# EAGLE board mosfet_ctl (EAGLE 9.6.0), part 1 of 2
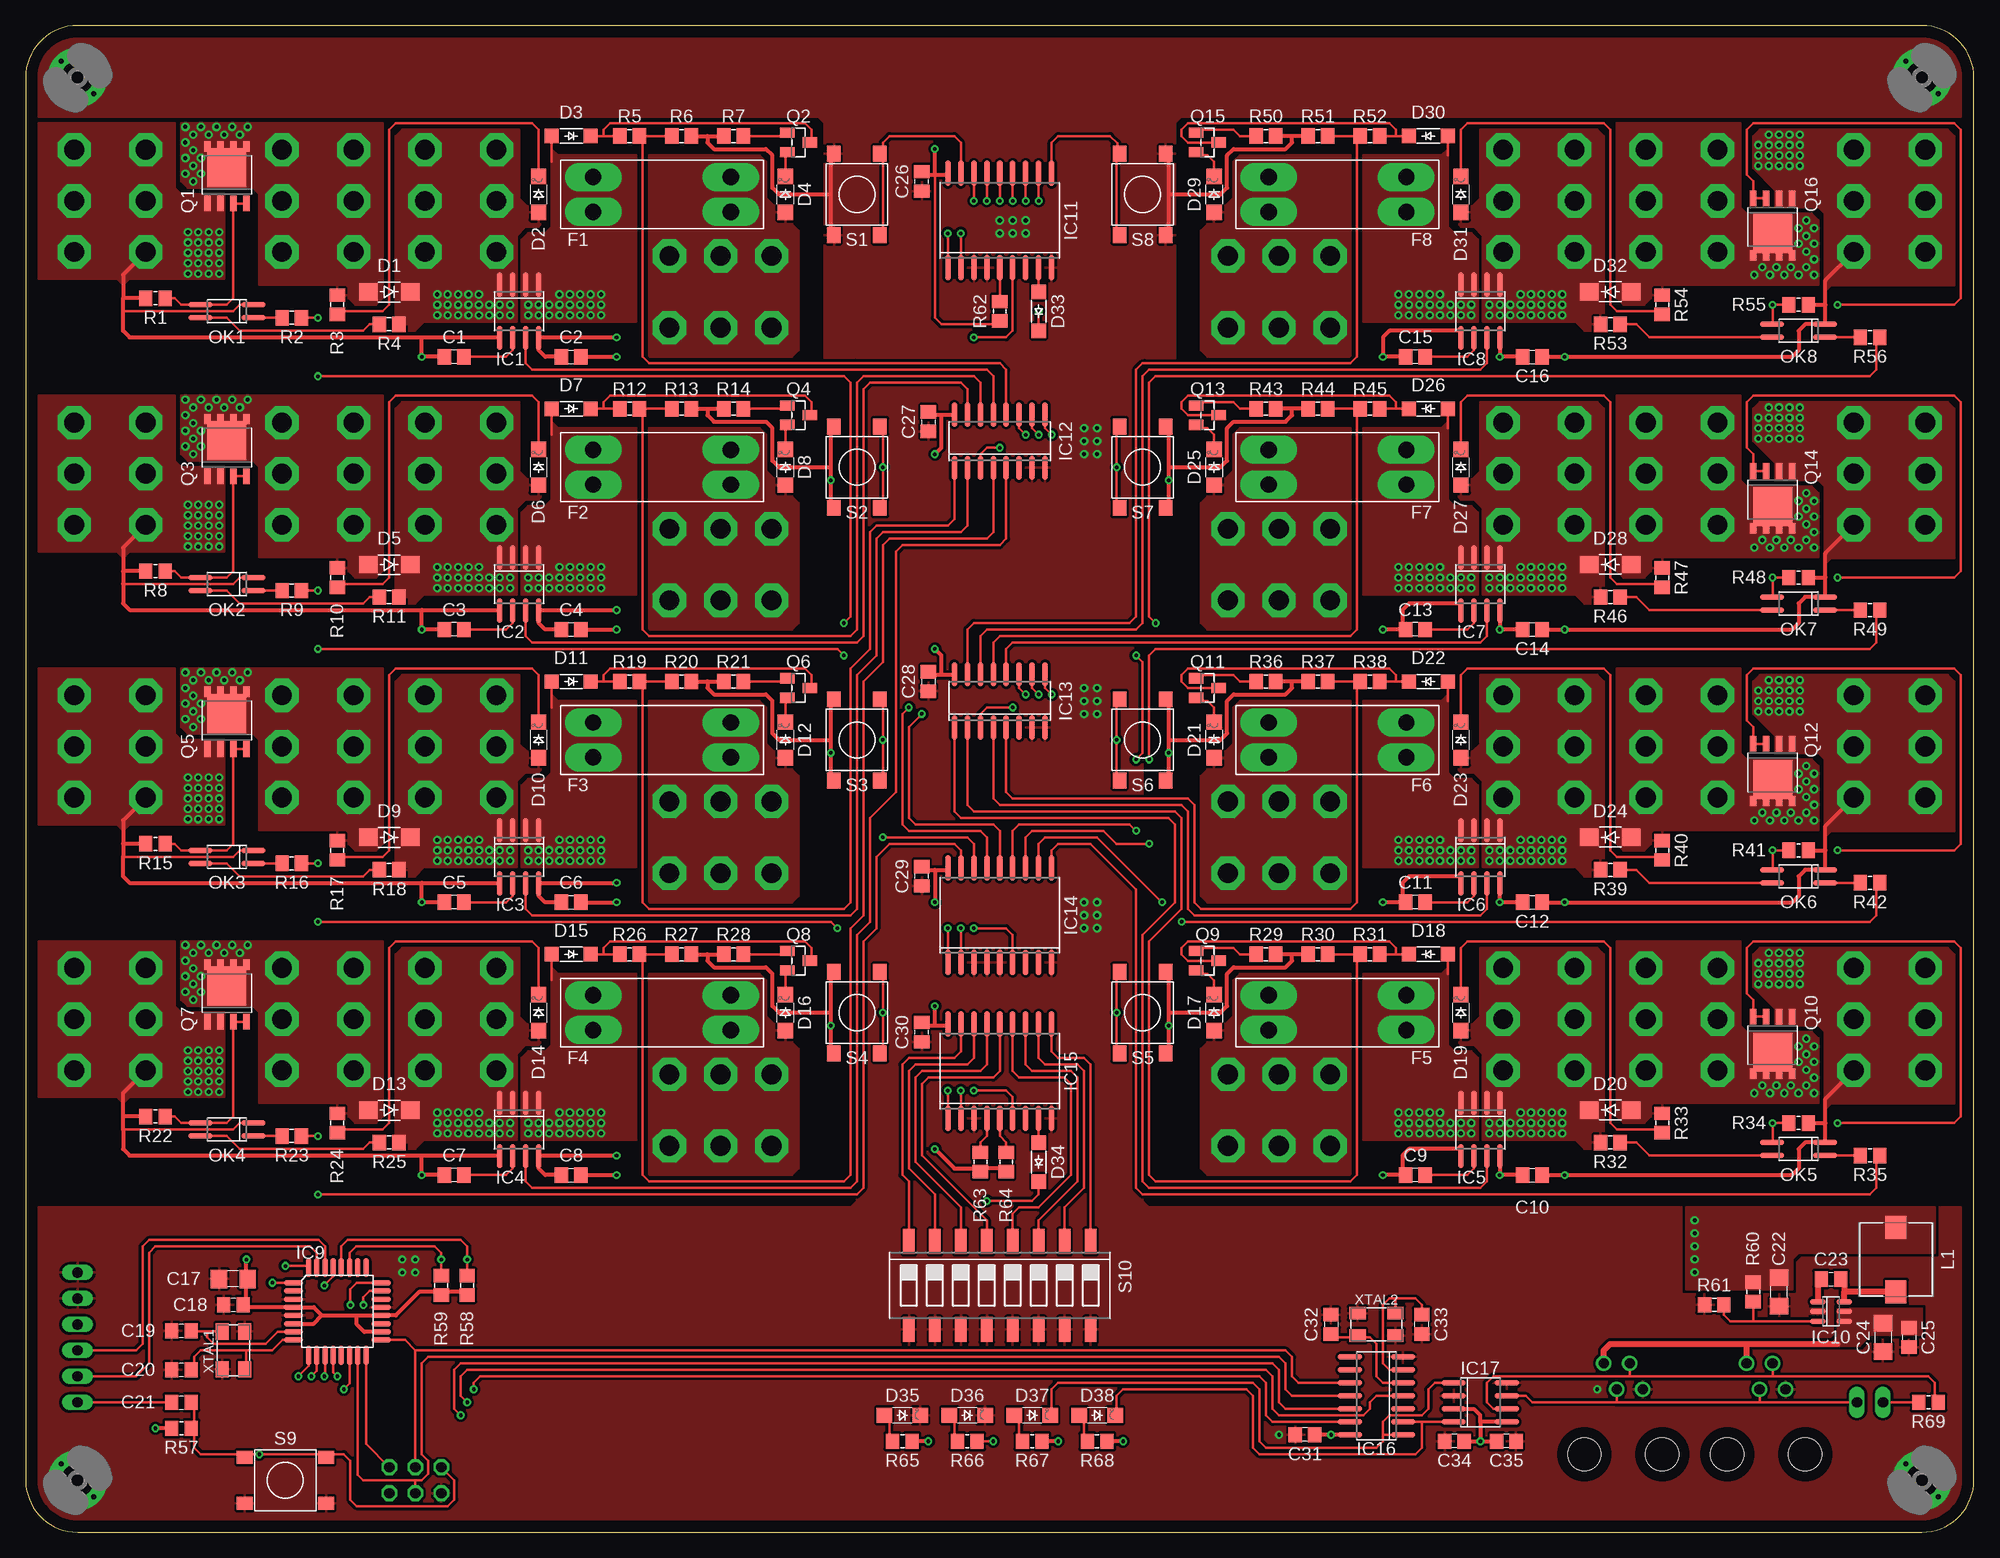
[diagram p3: board, top side]
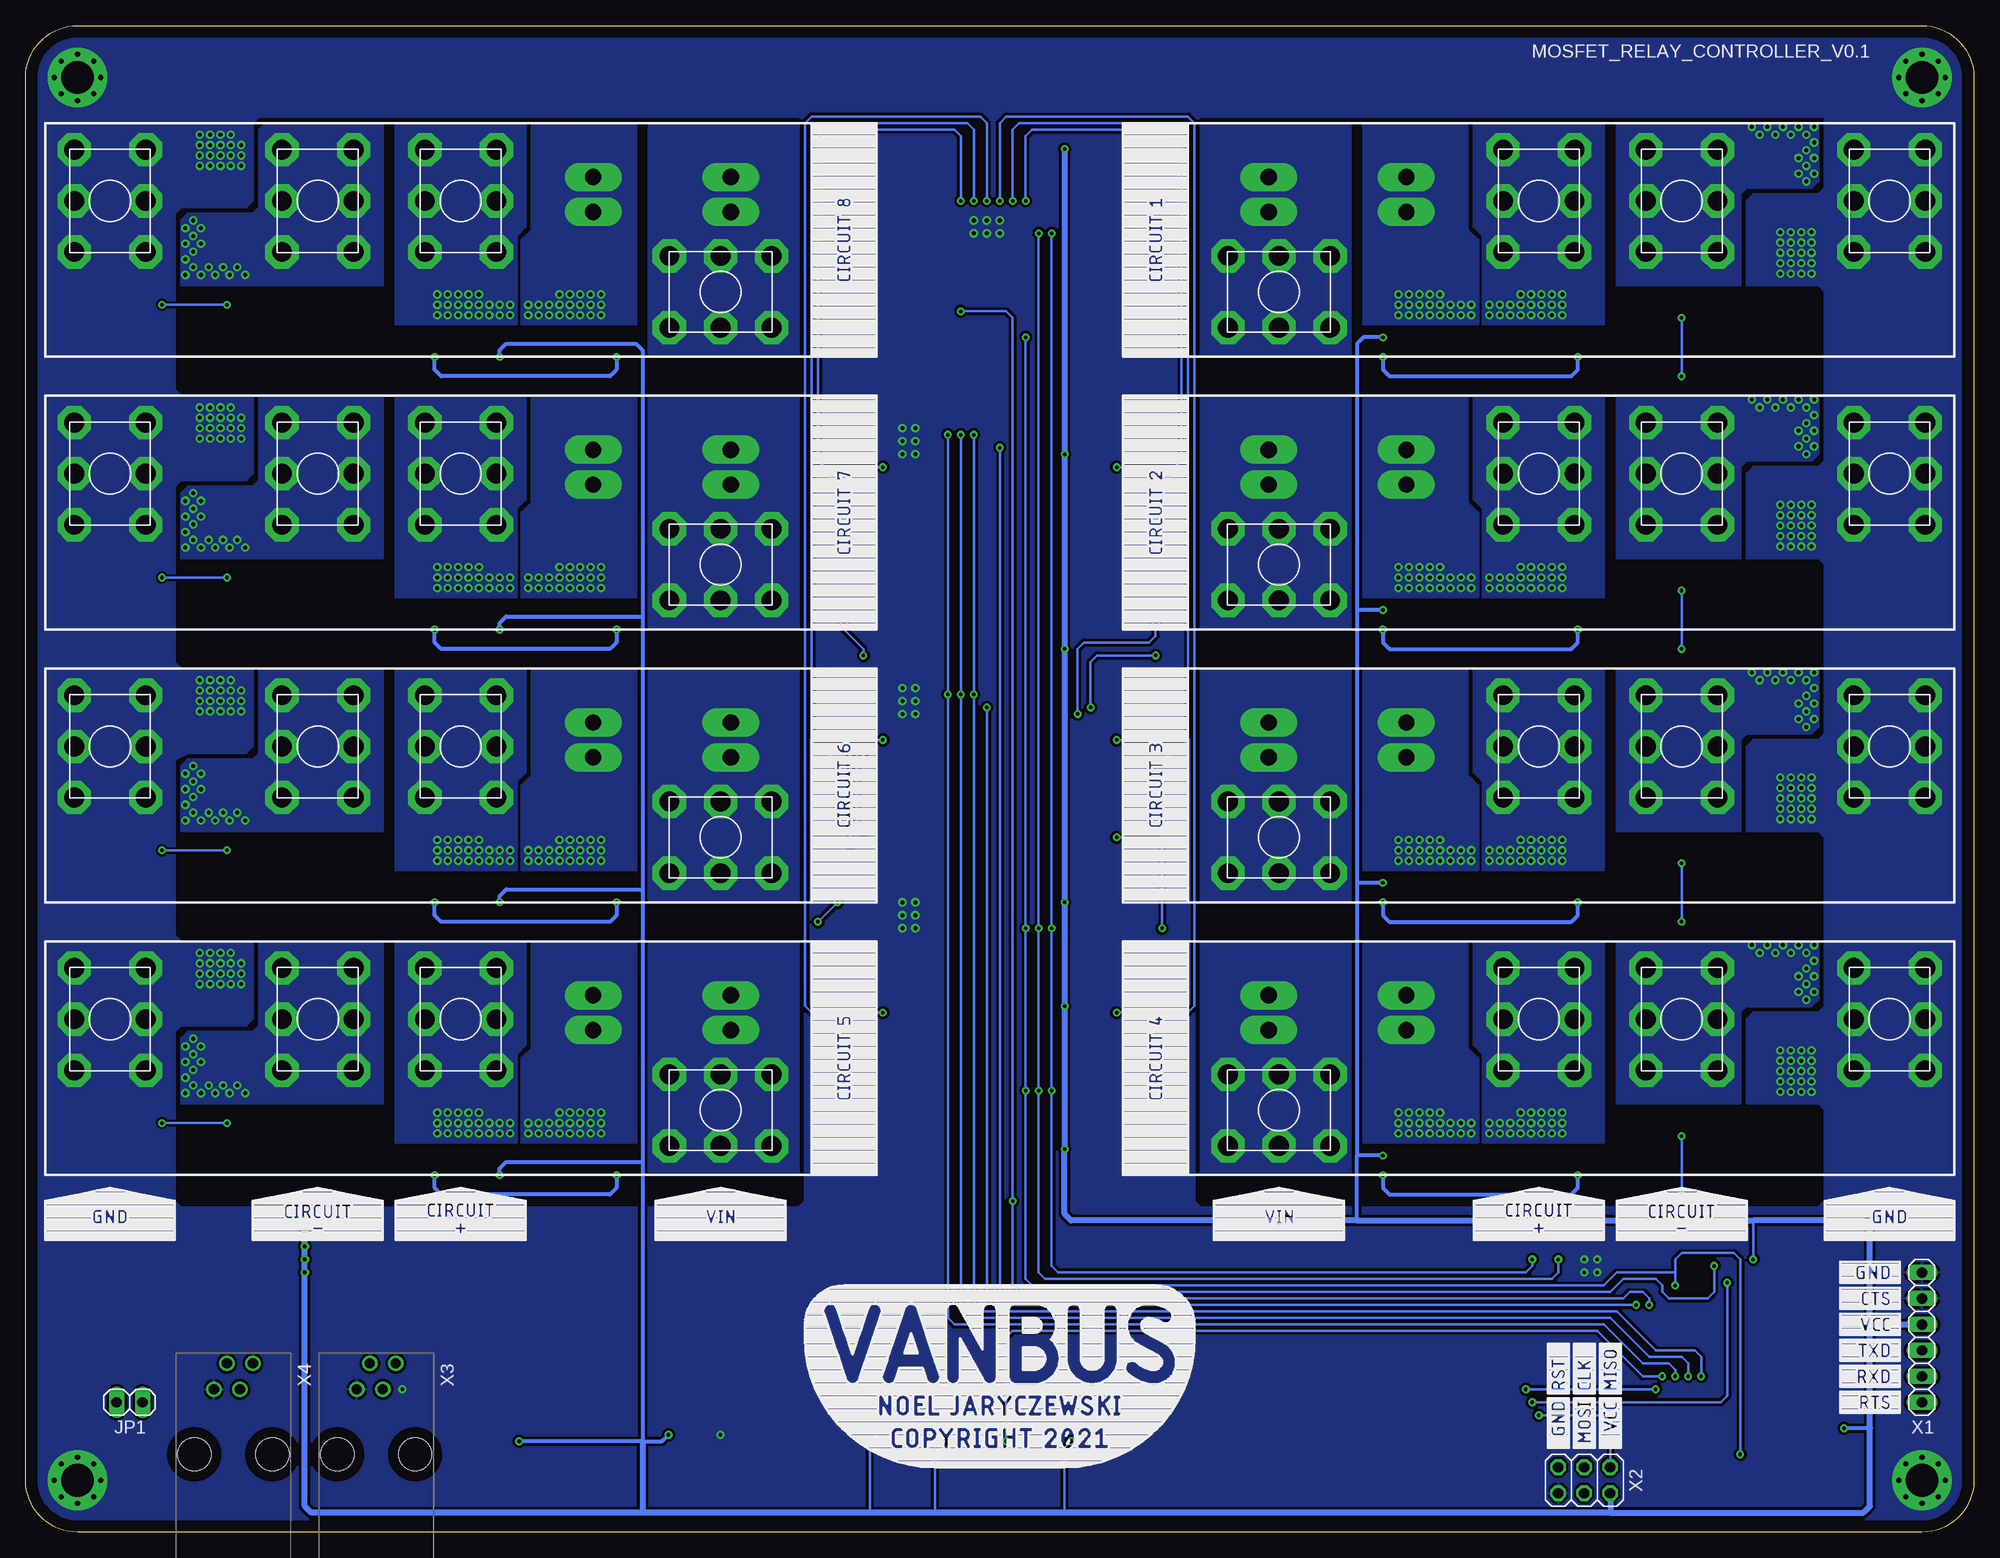
[diagram p4: board, bottom side, seen from below]

Size 190.5 x 147.32 mm. Coordinates in mm from the lower left corner, seen from the top.
Outline: 185.42,147.32 5.08,147.32 arc90 0,142.24 0,5.08 arc90 5.08,0 185.42,0 arc90 190.5,5.08 190.5,142.24 arc90 185.42,147.32
Copper layers (1*16): Top 0.035mm / dielectric 1.5mm / Bottom 0.035mm
Design rules "default *": minimum track width 6mil, minimum drill 0.35mm, track to track 8mil, track to pad 8mil, pad to pad 8mil, via to via 8mil, smd to smd 8mil, copper to edge 40mil, drill to drill 6mil, minimum pad ring 10mil, minimum via ring 8mil, stop-mask expansion 4mil, vias tented up to drill 16mil, thermal gap 10mil

## Footprints (pad centres in the part's own frame; a part is rotated, then mirrored left to right if it is on the bottom)
C0805 = smd 1.3 x 1.5: 1 -0.95,0; 2 0.95,0
C1206 = smd 1.6 x 1.8: 1 -1.4,0; 2 1.4,0
DO214AC = smd 1.8 x 1.7: A 2.05,0; C -2.05,0
CHIPLED_1206 = smd 1.5 x 1.5: A 0,-1.75; C 0,1.75
SOD123 = smd 1.4 x 1.4: A 1.9,0; C -1.9,0
KEYSTONE_3557-2 = drill 1.6 pad 2.794 long: 1 -6.735,1.7; 2 6.735,1.7; 3 -6.735,-1.7; 4 6.735,-1.7
3,2-PAD = drill 3.2 pad 5.842: B3,2 0,0 | drill 0.5: P$1 0,2.261; P$2 0,-2.261; P$3 2.261,0; P$4 -2.261,0; P$5 -1.598,1.598; P$6 1.598,1.598; P$7 -1.598,-1.598; P$8 1.598,-1.598
SO08 = smd 0.559 x 2.388: 1 -1.905,-2.6; 2 -0.635,-2.6; 3 0.635,-2.6; 4 1.905,-2.6; 5 1.905,2.6; 6 0.635,2.6; 7 -0.635,2.6; 8 -1.905,2.6
TQFP32_0.8MM_7X7MM = smd 1.905 x 0.559: 1 -4.293,2.8; 2 -4.293,2; 3 -4.293,1.2; 4 -4.293,0.4; 5 -4.293,-0.4; 6 -4.293,-1.2; 7 -4.293,-2; 8 -4.293,-2.8; 17 4.293,-2.8; 18 4.293,-2; 19 4.293,-1.2; 20 4.293,-0.4; 21 4.293,0.4; 22 4.293,1.2; 23 4.293,2; 24 4.293,2.8 | smd 0.559 x 1.905: 9 -2.8,-4.293; 10 -2,-4.293; 11 -1.2,-4.293; 12 -0.4,-4.293; 13 0.4,-4.293; 14 1.2,-4.293; 15 2,-4.293; 16 2.8,-4.293; 25 2.8,4.293; 26 2,4.293; 27 1.2,4.293; 28 0.4,4.293; 29 -0.4,4.293; 30 -1.2,4.293; 31 -2,4.293; 32 -2.8,4.293
SOT23-6 = smd 0.559 x 1.524: 1 0.95,1.3; 2 0,1.3; 3 -0.95,1.3; 4 -0.95,-1.3; 5 0,-1.3; 6 0.95,-1.3
SO18W = smd 0.559 x 2.515: 1 -5.08,-4.6; 2 -3.81,-4.6; 3 -2.54,-4.6; 4 -1.27,-4.6; 5 0,-4.6; 6 1.27,-4.6; 7 2.54,-4.6; 8 3.81,-4.6; 9 5.08,-4.6; 10 5.08,4.6; 11 3.81,4.6; 12 2.54,4.6; 13 1.27,4.6; 14 0,4.6; 15 -1.27,4.6; 16 -2.54,4.6; 17 -3.81,4.6; 18 -5.08,4.6
SO16 = smd 0.559 x 2.388: 1 -4.445,-2.6; 2 -3.175,-2.6; 3 -1.905,-2.6; 4 -0.635,-2.6; 5 0.635,-2.6; 6 1.905,-2.6; 7 3.175,-2.6; 8 4.445,-2.6; 9 4.445,2.6; 10 3.175,2.6; 11 1.905,2.6; 12 0.635,2.6; 13 -0.635,2.6; 14 -1.905,2.6; 15 -3.175,2.6; 16 -4.445,2.6
SO14 = smd 0.559 x 2.388: 1 -3.81,-2.6; 2 -2.54,-2.6; 3 -1.27,-2.6; 4 0,-2.6; 5 1.27,-2.6; 6 2.54,-2.6; 7 3.81,-2.6; 8 3.81,2.6; 9 2.54,2.6; 10 1.27,2.6; 11 0,2.6; 12 -1.27,2.6; 13 -2.54,2.6; 14 -3.81,2.6
1X02 = drill 1.016 long: 1 -1.27,0; 2 1.27,0
L_7.3MM = smd 2.25 x 2.05: 1 -3.15,0; 2 3.15,0
SO04 = smd 0.559 x 2.388: 1 -0.635,-2.6; 2 0.635,-2.6; 3 0.635,2.6; 4 -0.635,2.6
POWERPAK-SO8 = smd 0.61 x 1.524: 1 -1.905,-2.794; 2 -0.635,-2.794; 3 0.635,-2.794; 4 1.905,-2.794 | smd 0.61 x 1.016: 5 1.905,2.794; 6 0.635,2.794; 7 -0.635,2.794; 8 -1.905,2.794 | smd 3.81 x 3.81: 9 0,0.686
SOT23 = smd 1 x 1.4: 1 -0.95,-1.1; 2 0.95,-1.1; 3 0,1.1
R0805 = smd 1.3 x 1.5: 1 -0.95,0; 2 0.95,0
TACTILE_SWITCH_SMD_6.2MM = smd 1.55 x 1.3: A1 -3.975,-2.25; A2 3.975,-2.25; B1 -3.975,2.25; B2 3.975,2.25
CTS-219-08 = smd 1.13 x 2.44: 1 -8.89,-4.3; 2 -6.35,-4.3; 3 -3.81,-4.3; 4 -1.27,-4.3; 5 1.27,-4.3; 6 3.81,-4.3; 7 6.35,-4.3; 8 8.89,-4.3; 9 8.89,4.3; 10 6.35,4.3; 11 3.81,4.3; 12 1.27,4.3; 13 -1.27,4.3; 14 -3.81,4.3; 15 -6.35,4.3; 16 -8.89,4.3
1X06 = drill 1.016 long: 1 -6.35,0; 2 -3.81,0; 3 -1.27,0; 4 1.27,0; 5 3.81,0; 6 6.35,0
2X03 = drill 1.016 octagon: 1 -2.54,-1.27; 2 -2.54,1.27; 3 0,-1.27; 4 0,1.27; 5 2.54,-1.27; 6 2.54,1.27
RJ11-4_HORIZ = drill 1: 1 -1.905,-8.89; 2 -0.635,-6.35; 3 0.635,-8.89; 4 1.905,-6.35 | hole 3.25: -3.81,0; 3.81,0
KEYSTONE_7800 = drill 1.93 pad 3.25 octagon: 1 -3.5,5; 2 -3.5,0; 3 -3.5,-5; 4 3.5,-5; 5 3.5,0; 6 3.5,5
XTAL_5.0X3.2_4 = smd 1.6 x 1.25: 1 -1.85,-1.1; 2 1.85,-1.1; 3 1.85,1.1; 4 -1.85,1.1

## Placement (x,y rotation side)
C1  1n  [C0805]  41.91,114.94 180 top
C2  100n  [C0805]  53.34,114.94 0 top
C3  1n  [C0805]  41.91,88.27 180 top
C4  100n  [C0805]  53.34,88.27 0 top
C5  1n  [C0805]  41.91,61.59 180 top
C6  100n  [C0805]  53.34,61.59 0 top
C7  1n  [C0805]  41.91,34.92 180 top
C8  100n  [C0805]  53.34,34.92 0 top
C9  1n  [C0805]  135.89,34.92 180 top
C10  100n  [C0805]  147.32,34.92 0 top
C11  1n  [C0805]  135.89,61.59 180 top
C12  100n  [C0805]  147.32,61.59 0 top
C13  1n  [C0805]  135.89,88.27 180 top
C14  100n  [C0805]  147.32,88.27 0 top
C15  1n  [C0805]  135.89,114.94 180 top
C16  100n  [C0805]  147.32,114.94 0 top
C17  10u  [C1206]  20.32,24.77 180 top
C18  100n  [C0805]  20.32,22.23 180 top
C19  22p  [C0805]  15.24,19.68 180 top
C20  22p  [C0805]  15.24,15.88 180 top
C21  1u  [C0805]  15.24,12.7 0 top
C22  10u  [C1206]  171.45,23.5 90 top
C23  100n  [C0805]  176.53,24.77 0 top
C24  10u  [C1206]  181.61,19.05 270 top
C25  100n  [C0805]  184.15,19.05 270 top
C26  100n  [C0805]  87.63,132.08 90 top
C27  100n  [C0805]  88.27,108.58 270 top
C28  100n  [C0805]  88.27,83.19 270 top
C29  100n  [C0805]  87.63,64.14 90 top
C30  100n  [C0805]  87.63,48.9 90 top
C31  100n  [C0805]  125.09,9.53 180 top
C32  22p  [C0805]  127.64,20.32 270 top
C33  22p  [C0805]  136.53,20.32 90 top
C34  100n  [C0805]  139.7,8.89 180 top
C35  100n  [C0805]  144.78,8.89 180 top
D1  TVS 15V  [DO214AC]  35.56,121.28 180 top
D2  GREEN  [CHIPLED_1206]  50.16,130.81 0 top
D3  1N4148  [SOD123]  53.34,136.53 180 top
D4  RED  [CHIPLED_1206]  74.3,130.81 0 top
D5  TVS 15V  [DO214AC]  35.56,94.61 180 top
D6  GREEN  [CHIPLED_1206]  50.16,104.14 0 top
D7  1N4148  [SOD123]  53.34,109.86 180 top
D8  RED  [CHIPLED_1206]  74.3,104.14 0 top
D9  TVS 15V  [DO214AC]  35.56,67.94 180 top
D10  GREEN  [CHIPLED_1206]  50.16,77.47 0 top
D11  1N4148  [SOD123]  53.34,83.19 180 top
D12  RED  [CHIPLED_1206]  74.3,77.47 0 top
D13  TVS 15V  [DO214AC]  35.56,41.27 180 top
D14  GREEN  [CHIPLED_1206]  50.16,50.8 0 top
D15  1N4148  [SOD123]  53.34,56.52 180 top
D16  RED  [CHIPLED_1206]  74.3,50.8 0 top
D17  RED  [CHIPLED_1206]  116.2,50.8 0 top
D18  1N4148  [SOD123]  137.16,56.52 0 top
D19  GREEN  [CHIPLED_1206]  140.34,50.8 0 top
D20  TVS 15V  [DO214AC]  154.94,41.27 0 top
D21  RED  [CHIPLED_1206]  116.2,77.47 0 top
D22  1N4148  [SOD123]  137.16,83.19 0 top
D23  GREEN  [CHIPLED_1206]  140.34,77.47 0 top
D24  TVS 15V  [DO214AC]  154.94,67.94 0 top
D25  RED  [CHIPLED_1206]  116.2,104.14 0 top
D26  1N4148  [SOD123]  137.16,109.86 0 top
D27  GREEN  [CHIPLED_1206]  140.34,104.14 0 top
D28  TVS 15V  [DO214AC]  154.94,94.61 0 top
D29  RED  [CHIPLED_1206]  116.2,130.81 0 top
D30  1N4148  [SOD123]  137.16,136.53 0 top
D31  GREEN  [CHIPLED_1206]  140.34,130.81 0 top
D32  TVS 15V  [DO214AC]  154.94,121.28 0 top
D33  1N4148  [SOD123]  99.06,119.38 90 top
D34  1N4148  [SOD123]  99.06,36.2 90 top
D35  GREEN  [CHIPLED_1206]  85.72,11.43 270 top
D36  RED  [CHIPLED_1206]  92.08,11.43 270 top
D37  AMBER  [CHIPLED_1206]  98.42,11.43 270 top
D38  AMBER  [CHIPLED_1206]  104.78,11.43 270 top
F1  30A  [KEYSTONE_3557-2]  62.23,130.81 180 top
F2  30A  [KEYSTONE_3557-2]  62.23,104.14 180 top
F3  30A  [KEYSTONE_3557-2]  62.23,77.47 180 top
F4  30A  [KEYSTONE_3557-2]  62.23,50.8 180 top
F5  30A  [KEYSTONE_3557-2]  128.27,50.8 0 top
F6  30A  [KEYSTONE_3557-2]  128.27,77.47 0 top
F7  30A  [KEYSTONE_3557-2]  128.27,104.14 0 top
F8  30A  [KEYSTONE_3557-2]  128.27,130.81 0 top
H1  MOUNT-PAD-ROUND3.2  [3,2-PAD]  185.42,142.24 0 top
H2  MOUNT-PAD-ROUND3.2  [3,2-PAD]  5.08,142.24 0 top
H3  MOUNT-PAD-ROUND3.2  [3,2-PAD]  185.42,5.08 0 top
H4  MOUNT-PAD-ROUND3.2  [3,2-PAD]  5.08,5.08 0 top
IC1  ACS712  [SO08]  48.26,119.38 180 top
IC2  ACS712  [SO08]  48.26,92.71 180 top
IC3  ACS712  [SO08]  48.26,66.04 180 top
IC4  ACS712  [SO08]  48.26,39.37 180 top
IC5  ACS712  [SO08]  142.24,39.37 180 top
IC6  ACS712  [SO08]  142.24,66.04 180 top
IC7  ACS712  [SO08]  142.24,92.71 180 top
IC8  ACS712  [SO08]  142.24,119.38 180 top
IC9  ATMEGA328PTQFP  [TQFP32_0.8MM_7X7MM]  30.48,21.59 0 top
IC10  LMR50410  [SOT23-6]  176.53,21.59 90 top
IC11  MCP23008  [SO18W]  95.25,128.27 0 top
IC12  4051  [SO16]  95.25,106.68 0 top
IC13  4051  [SO16]  95.25,81.28 0 top
IC14  MCP23008  [SO18W]  95.25,60.33 0 top
IC15  MCP23008  [SO18W]  95.25,45.09 0 top
IC16  MCP2518  [SO14]  132.08,13.34 90 top
IC17  MCP2562FD  [SO08]  142.24,12.7 270 top
JP1  CAN_TERMINATOR  [1X02]  180.34,12.7 180 bottom
L1  12u  [L_7.3MM]  182.88,26.67 90 top
OK1  TLP290  [SO04]  19.68,119.38 90 top
OK2  TLP290  [SO04]  19.68,92.71 90 top
OK3  TLP290  [SO04]  19.68,66.04 90 top
OK4  TLP290  [SO04]  19.68,39.37 90 top
OK5  TLP290  [SO04]  173.35,37.47 90 top
OK6  TLP290  [SO04]  173.35,64.14 90 top
OK7  TLP290  [SO04]  173.35,90.81 90 top
OK8  TLP290  [SO04]  173.35,117.47 90 top
Q1  SIRA80DP-T1-RE3  [POWERPAK-SO8]  19.68,132.72 0 top
Q2  BC857  [SOT23]  75.56,135.89 270 top
Q3  SIRA80DP-T1-RE3  [POWERPAK-SO8]  19.68,106.05 0 top
Q4  BC857  [SOT23]  75.56,109.22 270 top
Q5  SIRA80DP-T1-RE3  [POWERPAK-SO8]  19.68,79.38 0 top
Q6  BC857  [SOT23]  75.56,82.55 270 top
Q7  SIRA80DP-T1-RE3  [POWERPAK-SO8]  19.68,52.7 0 top
Q8  BC857  [SOT23]  75.56,55.88 270 top
Q9  BC857  [SOT23]  115.57,55.88 270 top
Q10  SIRA80DP-T1-RE3  [POWERPAK-SO8]  170.81,47.62 180 top
Q11  BC857  [SOT23]  115.57,82.55 270 top
Q12  SIRA80DP-T1-RE3  [POWERPAK-SO8]  170.81,74.3 180 top
Q13  BC857  [SOT23]  115.57,109.22 270 top
Q14  SIRA80DP-T1-RE3  [POWERPAK-SO8]  170.81,100.97 180 top
Q15  BC857  [SOT23]  115.57,135.89 270 top
Q16  SIRA80DP-T1-RE3  [POWERPAK-SO8]  170.81,127.64 180 top
R1  1k  [R0805]  12.7,120.65 0 top
R2  1k  [R0805]  26.04,118.75 180 top
R3  2k2  [R0805]  30.48,120.02 270 top
R4  1k  [R0805]  35.56,118.11 0 top
R5  33k  [R0805]  59.05,136.53 180 top
R6  16k  [R0805]  64.14,136.53 180 top
R7  2k2  [R0805]  69.22,136.53 0 top
R8  1k  [R0805]  12.7,93.98 0 top
R9  1k  [R0805]  26.04,92.08 180 top
R10  2k2  [R0805]  30.48,93.34 270 top
R11  1k  [R0805]  35.56,91.44 0 top
R12  33k  [R0805]  59.05,109.86 180 top
R13  16k  [R0805]  64.14,109.86 180 top
R14  2k2  [R0805]  69.22,109.86 0 top
R15  1k  [R0805]  12.7,67.31 0 top
R16  1k  [R0805]  26.04,65.41 180 top
R17  2k2  [R0805]  30.48,66.67 270 top
R18  1k  [R0805]  35.56,64.77 0 top
R19  33k  [R0805]  59.05,83.19 180 top
R20  16k  [R0805]  64.14,83.19 180 top
R21  2k2  [R0805]  69.22,83.19 0 top
R22  1k  [R0805]  12.7,40.64 0 top
R23  1k  [R0805]  26.04,38.73 180 top
R24  2k2  [R0805]  30.48,40.01 270 top
R25  1k  [R0805]  35.56,38.1 0 top
R26  33k  [R0805]  59.05,56.52 180 top
R27  16k  [R0805]  64.14,56.52 180 top
R28  2k2  [R0805]  69.22,56.52 0 top
R29  2k2  [R0805]  121.28,56.52 180 top
R30  16k  [R0805]  126.36,56.52 0 top
R31  33k  [R0805]  131.44,56.52 0 top
R32  1k  [R0805]  154.94,38.1 180 top
R33  2k2  [R0805]  160.02,40.01 270 top
R34  1k  [R0805]  173.35,40.01 180 top
R35  1k  [R0805]  180.34,36.83 180 top
R36  2k2  [R0805]  121.28,83.19 180 top
R37  16k  [R0805]  126.36,83.19 0 top
R38  33k  [R0805]  131.44,83.19 0 top
R39  1k  [R0805]  154.94,64.77 180 top
R40  2k2  [R0805]  160.02,66.67 270 top
R41  1k  [R0805]  173.35,66.67 180 top
R42  1k  [R0805]  180.34,63.5 180 top
R43  2k2  [R0805]  121.28,109.86 180 top
R44  16k  [R0805]  126.36,109.86 0 top
R45  33k  [R0805]  131.44,109.86 0 top
R46  1k  [R0805]  154.94,91.44 180 top
R47  2k2  [R0805]  160.02,93.34 270 top
R48  1k  [R0805]  173.35,93.34 180 top
R49  1k  [R0805]  180.34,90.17 180 top
R50  2k2  [R0805]  121.28,136.53 180 top
R51  16k  [R0805]  126.36,136.53 0 top
R52  33k  [R0805]  131.44,136.53 0 top
R53  1k  [R0805]  154.94,118.11 180 top
R54  2k2  [R0805]  160.02,120.02 270 top
R55  1k  [R0805]  173.35,120.02 180 top
R56  1k  [R0805]  180.34,116.84 180 top
R57  10k  [R0805]  15.24,10.16 180 top
R58  2k2  [R0805]  43.18,24.13 270 top
R59  2k2  [R0805]  40.64,24.13 90 top
R60  88k7  [R0805]  168.91,23.5 90 top
R61  22k1  [R0805]  165.1,22.23 0 top
R62  10k  [R0805]  95.25,119.38 270 top
R63  10k  [R0805]  93.34,36.2 270 top
R64  10k  [R0805]  95.89,36.2 270 top
R65  2k2  [R0805]  85.72,8.89 0 top
R66  2k2  [R0805]  92.08,8.89 0 top
R67  470  [R0805]  98.42,8.89 0 top
R68  470  [R0805]  104.78,8.89 0 top
R69  120  [R0805]  186.06,12.7 180 top
S1  TACTILE_SWITCH6.2MM  [TACTILE_SWITCH_SMD_6.2MM]  81.28,130.81 270 top
S2  TACTILE_SWITCH6.2MM  [TACTILE_SWITCH_SMD_6.2MM]  81.28,104.14 270 top
S3  TACTILE_SWITCH6.2MM  [TACTILE_SWITCH_SMD_6.2MM]  81.28,77.47 270 top
S4  TACTILE_SWITCH6.2MM  [TACTILE_SWITCH_SMD_6.2MM]  81.28,50.8 270 top
S5  TACTILE_SWITCH6.2MM  [TACTILE_SWITCH_SMD_6.2MM]  109.22,50.8 90 top
S6  TACTILE_SWITCH6.2MM  [TACTILE_SWITCH_SMD_6.2MM]  109.22,77.47 90 top
S7  TACTILE_SWITCH6.2MM  [TACTILE_SWITCH_SMD_6.2MM]  109.22,104.14 90 top
S8  TACTILE_SWITCH6.2MM  [TACTILE_SWITCH_SMD_6.2MM]  109.22,130.81 90 top
S9  TACTILE_SWITCH6.2MM  [TACTILE_SWITCH_SMD_6.2MM]  25.4,5.08 0 top
S10  SWITCH_DIL08  [CTS-219-08]  95.25,24.13 180 top
X1  FTDI  [1X06]  5.08,19.05 270 bottom
X2  ISCP  [2X03]  38.1,5.08 180 bottom
X3  RJ11-4HORIZ  [RJ11-4_HORIZ]  156.21,7.62 180 bottom
X4  RJ11-4HORIZ  [RJ11-4_HORIZ]  170.18,7.62 180 bottom
X9  KEYSTONE_7800  [KEYSTONE_7800]  67.94,121.28 90 bottom
X10  KEYSTONE_7800  [KEYSTONE_7800]  8.26,130.18 0 bottom
X11  KEYSTONE_7800  [KEYSTONE_7800]  42.55,130.18 0 bottom
X12  KEYSTONE_7800  [KEYSTONE_7800]  28.57,130.18 0 bottom
X13  KEYSTONE_7800  [KEYSTONE_7800]  122.56,121.28 90 bottom
X14  KEYSTONE_7800  [KEYSTONE_7800]  182.25,130.18 0 bottom
X15  KEYSTONE_7800  [KEYSTONE_7800]  147.96,130.18 0 bottom
X16  KEYSTONE_7800  [KEYSTONE_7800]  161.93,130.18 0 bottom
X17  KEYSTONE_7800  [KEYSTONE_7800]  67.94,94.61 90 bottom
X18  KEYSTONE_7800  [KEYSTONE_7800]  8.26,103.5 0 bottom
X19  KEYSTONE_7800  [KEYSTONE_7800]  42.55,103.5 0 bottom
X20  KEYSTONE_7800  [KEYSTONE_7800]  28.57,103.5 0 bottom
X21  KEYSTONE_7800  [KEYSTONE_7800]  122.56,94.61 90 bottom
X22  KEYSTONE_7800  [KEYSTONE_7800]  182.25,103.5 0 bottom
X23  KEYSTONE_7800  [KEYSTONE_7800]  147.96,103.5 0 bottom
X24  KEYSTONE_7800  [KEYSTONE_7800]  161.93,103.5 0 bottom
X25  KEYSTONE_7800  [KEYSTONE_7800]  67.94,67.94 90 bottom
X26  KEYSTONE_7800  [KEYSTONE_7800]  8.26,76.83 0 bottom
X27  KEYSTONE_7800  [KEYSTONE_7800]  42.55,76.83 0 bottom
X28  KEYSTONE_7800  [KEYSTONE_7800]  28.57,76.83 0 bottom
X29  KEYSTONE_7800  [KEYSTONE_7800]  122.56,67.94 90 bottom
X30  KEYSTONE_7800  [KEYSTONE_7800]  182.25,76.83 0 bottom
X31  KEYSTONE_7800  [KEYSTONE_7800]  147.96,76.83 0 bottom
X32  KEYSTONE_7800  [KEYSTONE_7800]  161.93,76.83 0 bottom
X33  KEYSTONE_7800  [KEYSTONE_7800]  67.94,41.27 90 bottom
X34  KEYSTONE_7800  [KEYSTONE_7800]  8.26,50.16 0 bottom
X35  KEYSTONE_7800  [KEYSTONE_7800]  42.55,50.16 0 bottom
X36  KEYSTONE_7800  [KEYSTONE_7800]  28.57,50.16 0 bottom
X37  KEYSTONE_7800  [KEYSTONE_7800]  122.56,41.27 90 bottom
X38  KEYSTONE_7800  [KEYSTONE_7800]  182.25,50.16 0 bottom
X39  KEYSTONE_7800  [KEYSTONE_7800]  147.96,50.16 0 bottom
X40  KEYSTONE_7800  [KEYSTONE_7800]  161.93,50.16 0 bottom
XTAL1  16MHz  [XTAL_5.0X3.2_4]  20.32,17.78 270 top
XTAL2  40MHz  [XTAL_5.0X3.2_4]  132.08,20.32 0 top

## Tracks (layer width: path | path; a pad name or v marks a point on that pad's centre or on a via)
+12V
  Top 0.61: X3.1 154.31,17.78 154.94,18.41 168.28,18.41 | X4.1 168.28,18.41 | C25.1 184.47,19.68 | 168.28,18.41 177.16,18.41
  pour Top (isolate 0.254, no thermals): 177.16,21.84 177.16,19.05 176.53,18.41 176.53,18.24 179.32,18.24 180.39,19.3 185.42,19.3 185.42,21.84
ADC_MUX_A  (via drill 0.35)
  Top 0.254: IC12.11 97.16,107.95 v97.79,107.31 | IC13.11 97.16,82.55 v97.79,81.92 | IC9.9 27.68,16.25 v26.67,15.24
  Bottom 0.254: v97.79,107.31 v97.79,81.92 97.79,22.23 97.16,21.59 34.92,21.59 31.11,17.78 27.3,17.78 26.67,17.14 v26.67,15.24
ADC_MUX_B  (via drill 0.35)
  Top 0.254: IC12.10 98.42,107.95 v99.06,107.31 | IC13.10 98.42,82.55 v99.06,81.92 | IC9.10 28.48,15.78 v27.94,15.24
  Bottom 0.254: v99.06,107.31 v99.06,81.92 99.06,21.59 98.42,20.95 35.56,20.95 31.75,17.14 28.57,17.14 27.94,16.51 v27.94,15.24
ADC_MUX_C  (via drill 0.35)
  Top 0.254: IC12.9 99.69,107.95 v100.33,107.31 | IC13.9 99.69,82.55 v100.33,81.92 | IC9.11 29.28,15.31 v29.21,15.24
  Bottom 0.254: v100.33,107.31 v100.33,81.92 100.33,20.95 99.69,20.32 36.2,20.32 32.38,16.51 29.84,16.51 29.21,15.88 v29.21,15.24
GND  (via drill 0.35, 0.4)
  Top 0.254: OK1.2 20.95,120.02 20.32,119.38 9.53,119.38 | 46.3,116.84 IC1.5 | 78.74,134.5 S1.A1 | S1.A2 78.74,127.12 | 175.97,118.17 OK8.2 | 111.76,127 111.59,126.83 S8.A1 | S8.A2 111.76,134.5 | IC8.5 140.34,117.47 | OK2.2 20.95,93.34 20.32,92.71 9.53,92.71 | 46.3,90.17 IC2.5 | 78.74,107.83 S2.A1 | S2.A2 78.74,100.45 | 175.97,91.5 OK7.2 | 111.76,100.33 111.59,100.17 S7.A1 | S7.A2 111.76,107.83 | IC7.5 140.34,90.81 | OK3.2 20.95,66.67 20.32,66.04 9.53,66.04 | 46.3,63.5 IC3.5 | 78.74,81.16 S3.A1 | S3.A2 78.74,73.78 | 175.97,64.83 OK6.2 | 111.76,73.66 111.59,73.5 S6.A1 | S6.A2 111.76,81.16 | IC6.5 140.34,64.14 | 134.62,61.91 C11.2 | OK4.2 20.95,40.01 20.32,39.37 9.53,39.37 | 46.3,36.83 IC4.5 | 78.74,54.48 S4.A1 | S4.A2 78.74,47.12 | 175.97,38.16 OK5.2 | 111.76,46.99 111.59,46.83 S5.A1 | S5.A2 111.76,54.48 | IC5.5 140.34,37.47 | 134.62,35.24 C9.2
  Top 0.406: 9.53,120.65 9.53,119.38 9.53,117.47 10.16,116.84 38.73,116.84 | R1.1 9.53,120.65 | 78.74,130.81 73.66,130.81 73.03,131.44 73.03,134.62 72.39,135.25 67.31,135.25 66.67,135.89 66.67,136.53 | 78.74,130.81 78.74,134.5 | 78.74,127.12 78.74,130.81 | R6.1 66.67,136.53 | 66.67,136.53 R7.1 | 38.73,116.84 46.3,116.84 | R55.1 175.97,120.02 | 175.97,118.17 175.97,120.02 | R51.1 123.83,136.53 | 123.83,136.53 R50.1 | 111.76,134.5 111.76,130.81 | 111.76,130.81 111.76,127 | 111.76,130.81 116.84,130.81 117.47,131.44 117.47,134.62 118.11,135.25 123.19,135.25 123.83,135.89 123.83,136.53 | 9.53,93.98 9.53,92.71 9.53,90.81 10.16,90.17 38.73,90.17 | R8.1 9.53,93.98 | 78.74,104.14 73.66,104.14 73.03,104.78 73.03,107.95 72.39,108.58 67.31,108.58 66.67,109.22 66.67,109.86 | 78.74,104.14 78.74,107.83 | 78.74,100.45 v78.74,102.87 78.74,104.14 | R13.1 66.67,109.86 | 66.67,109.86 R14.1 | C3.2 v38.73,88.27 38.73,90.17 | 38.73,90.17 46.3,90.17 | R48.1 175.97,93.34 | 175.97,91.5 175.97,93.34 | R44.1 123.83,109.86 | 123.83,109.86 R43.1 | 111.76,107.83 111.76,104.14 | 111.76,104.14 v111.76,102.87 111.76,100.33 | 111.76,104.14 116.84,104.14 117.47,104.78 117.47,107.95 118.11,108.58 123.19,108.58 123.83,109.22 123.83,109.86 | 140.34,90.81 135.25,90.81 134.62,90.17 134.62,88.27 | 9.53,67.31 9.53,66.04 9.53,64.14 10.16,63.5 38.73,63.5 | 78.74,77.47 73.66,77.47 73.03,78.11 73.03,81.28 72.39,81.92 67.31,81.92 66.67,82.55 66.67,83.19 | 78.74,77.47 78.74,81.16 | 78.74,73.78 v78.74,76.2 78.74,77.47 | R20.1 66.67,83.19 | 66.67,83.19 R21.1 | C5.2 v38.73,61.59 38.73,63.5 | 38.73,63.5 46.3,63.5 | R41.1 175.97,66.67 | 175.97,64.83 175.97,66.67 | R37.1 123.83,83.19
  Top 0.406: 123.83,83.19 R36.1 | 111.76,81.16 111.76,77.47 | 111.76,77.47 v111.76,76.2 111.76,73.66 | 111.76,77.47 116.84,77.47 117.47,78.11 117.47,81.28 118.11,81.92 123.19,81.92 123.83,82.55 123.83,83.19 | 140.34,64.14 135.25,64.14 134.62,63.5 134.62,61.91 | 9.53,40.64 9.53,39.37 9.53,37.47 10.16,36.83 38.73,36.83 | R22.1 9.53,40.64 | 78.74,50.8 73.66,50.8 73.03,51.44 73.03,54.61 72.39,55.24 67.31,55.24 66.67,55.88 66.67,56.52 | 78.74,50.8 78.74,54.48 | 78.74,47.12 v78.74,49.53 78.74,50.8 | R27.1 66.67,56.52 | 66.67,56.52 R28.1 | C7.2 v38.73,34.92 38.73,36.83 | 38.73,36.83 46.3,36.83 | R34.1 175.97,40.01 | 175.97,38.16 175.97,40.01 | R30.1 123.83,56.52 | 123.83,56.52 R29.1 | 111.76,54.48 111.76,50.8 | 111.76,50.8 v111.76,49.53 111.76,46.99 | 111.76,50.8 116.84,50.8 117.47,51.44 117.47,54.61 118.11,55.24 123.19,55.24 123.83,55.88 123.83,56.52 | 140.34,37.47 135.25,37.47 134.62,36.83 134.62,35.24 | C1.2 v38.73,114.94 38.73,116.84 | C2.2 v57.78,114.94 | C4.2 v57.78,88.27 | C6.2 v57.78,61.59 | C8.2 v57.78,34.92 | C15.2 v132.72,114.94 132.72,116.84 133.35,117.47 140.34,117.47 | C11.2 v132.72,61.59 | C9.2 v132.72,34.92 | OK5.2 173.99,38.1 173.35,37.47 173.35,35.56 172.72,34.92 v150.5,34.92 C10.2 | OK6.2 173.99,64.77 173.35,64.14 173.35,62.23 172.72,61.59 v150.5,61.59 C12.2 | OK7.2 173.99,91.44 173.35,90.81 173.35,88.9 172.72,88.27 v150.5,88.27 C14.2 | OK8.2 173.99,118.11 173.35,117.47 173.35,115.57 172.72,114.94 v150.5,114.94 C16.2 | C13.2 134.62,88.27 | 134.62,88.27 v132.72,88.27 | X34.3 9.53,42.94 9.53,40.64 | R15.1 9.53,67.31 | X26.3 9.53,69.61 9.53,67.31 | X18.3 9.53,96.28 9.53,93.98 | X10.3 9.53,122.94 9.53,120.65
  Top 0.406: X38.4 175.97,42.39 175.97,40.01 | X30.4 175.97,69.06 175.97,66.67 | X22.4 175.97,95.73 175.97,93.34 | X14.4 175.97,122.4 175.97,120.02
  Bottom 0.406: v57.78,114.94 57.78,113.67 57.15,113.03 39.37,113.03 38.73,113.67 v38.73,114.94 | v57.78,88.27 57.78,87 57.15,86.36 39.37,86.36 38.73,87 v38.73,88.27 | v57.78,61.59 57.78,60.33 57.15,59.69 39.37,59.69 38.73,60.33 v38.73,61.59 | v57.78,34.92 57.78,33.66 57.15,33.02 39.37,33.02 38.73,33.66 v38.73,34.92 | v132.72,114.94 132.72,113.67 133.35,113.03 149.86,113.03 150.5,113.67 v150.5,114.94 | v132.72,88.27 132.72,87 133.35,86.36 149.86,86.36 150.5,87 v150.5,88.27 | v132.72,61.59 132.72,60.33 133.35,59.69 149.86,59.69 150.5,60.33 v150.5,61.59 | v132.72,34.92 132.72,33.66 133.35,33.02 149.86,33.02 150.5,33.66 v150.5,34.92
  other vias: 15.88,127.13 16.89,127.13 17.91,127.13 18.92,127.13 15.88,126.11 16.89,126.11 17.91,126.11 18.92,126.11 15.88,125.09 16.89,125.09 17.91,125.09 18.92,125.09 15.88,124.08 16.89,124.08 17.91,124.08 18.92,124.08 15.88,123.06 16.89,123.06 17.91,123.06 18.92,123.06 169.42,133.6 169.42,134.62 169.42,135.64 170.43,133.6 170.43,134.62 170.43,135.64 171.45,133.6 171.45,134.62 171.45,135.64 172.47,133.6 172.47,134.62 172.47,135.64 170.43,136.65 171.45,136.65 172.47,136.65 173.48,136.65 173.48,135.64 173.48,134.62 173.48,133.6 15.88,100.46 16.89,100.46 17.91,100.46 18.92,100.46 15.88,99.44 16.89,99.44 17.91,99.44 18.92,99.44 15.88,98.42 16.89,98.42 17.91,98.42 18.92,98.42 15.88,97.41 16.89,97.41 17.91,97.41 18.92,97.41 15.88,96.39 16.89,96.39 17.91,96.39 18.92,96.39 169.42,106.93 169.42,107.95 169.42,108.97 170.43,106.93 170.43,107.95 170.43,108.97 171.45,106.93 171.45,107.95 171.45,108.97 172.47,106.93 172.47,107.95 172.47,108.97 170.43,109.98 171.45,109.98 172.47,109.98 173.48,109.98 173.48,108.97 173.48,107.95 173.48,106.93 15.88,73.79 16.89,73.79 17.91,73.79 18.92,73.79 15.88,72.77 16.89,72.77 17.91,72.77 18.92,72.77 15.88,71.75 16.89,71.75 17.91,71.75 18.92,71.75 15.88,70.74 16.89,70.74 17.91,70.74 18.92,70.74 15.88,69.72 16.89,69.72 17.91,69.72 18.92,69.72 169.42,80.26 169.42,81.28 169.42,82.3 170.43,80.26 170.43,81.28 170.43,82.3 171.45,80.26 171.45,81.28 171.45,82.3 172.47,80.26 172.47,81.28 172.47,82.3 170.43,83.31 171.45,83.31 172.47,83.31 173.48,83.31 173.48,82.3 173.48,81.28 173.48,80.26 15.88,47.12 16.89,47.12 17.91,47.12 18.92,47.12 15.88,46.1 16.89,46.1 17.91,46.1 18.92,46.1 15.88,45.09 16.89,45.09 17.91,45.09 18.92,45.09 15.88,44.07 16.89,44.07 17.91,44.07 18.92,44.07 15.88,43.05 16.89,43.05 17.91,43.05 18.92,43.05 169.42,53.59 169.42,54.61 169.42,55.63 170.43,53.59 170.43,54.61 170.43,55.63 171.45,53.59 171.45,54.61 171.45,55.63 172.47,53.59 172.47,54.61 172.47,55.63 170.43,56.64 171.45,56.64 172.47,56.64 173.48,56.64 173.48,55.63 173.48,54.61 173.48,53.59 95.25,127 96.52,127 97.79,127 153.67,13.97 38.1,26.67 103.5,81.28 103.5,82.55 103.5,80.01 104.78,80.01 104.78,81.28 104.78,82.55 103.5,60.33 103.5,61.59 104.78,61.59 104.78,60.33 104.78,59.05 103.5,59.05 103.5,106.68 103.5,107.95 103.5,105.41 104.78,105.41 104.78,106.68 104.78,107.95 95.25,128.27 96.52,128.27 97.79,128.27 36.83,26.67 36.83,25.4 38.1,25.4 122.56,9.53
  pour Top (isolate 0.254, no thermals): 1.27,137.79 14.61,137.79 14.61,131.44 15.24,130.81 19.43,130.81 19.43,122.56 10.16,122.56 9.53,121.92 8.89,122.56 1.27,122.56
  pour Bottom (no thermals): 1.27,138.43 14.61,138.43 14.61,131.44 15.24,130.81 21.59,130.81 22.23,130.18 22.23,121.92 1.27,121.92
  pour Top (isolate 0.254, no thermals): 175.9,121.28 175.9,128.91 175.26,129.54 171.07,129.54 171.07,131.19 168.91,133.35 168.91,136.53 169.54,137.16 187.96,137.16 188.59,136.53 188.59,121.92 176.53,121.92
  pour Bottom (isolate 0.254, no thermals): 168.91,129.54 168.28,130.18 168.28,137.79 167.64,138.43 189.23,138.43 189.23,121.92 175.9,121.92 175.9,128.91 175.26,129.54
  pour Top (isolate 0.254, no thermals): 1.27,111.12 14.61,111.12 14.61,104.78 15.24,104.14 19.43,104.14 19.43,95.89 10.16,95.89 9.53,95.25 8.89,95.89 1.27,95.89
  pour Bottom (no thermals): 1.27,111.12 14.61,111.12 14.61,104.78 15.24,104.14 21.59,104.14 22.23,103.5 22.23,95.25 1.27,95.25
  pour Top (isolate 0.254, no thermals): 175.9,94.61 175.9,102.23 175.26,102.87 171.07,102.87 171.07,104.52 168.91,106.68 168.91,109.86 169.54,110.49 187.96,110.49 188.59,109.86 188.59,95.25 176.53,95.25
  pour Bottom (isolate 0.254, no thermals): 168.91,102.87 168.28,103.5 168.28,111.12 189.23,111.12 189.23,95.25 175.9,95.25 175.9,102.23 175.26,102.87
  pour Top (isolate 0.254, no thermals): 1.27,84.45 14.61,84.45 14.61,78.11 15.24,77.47 19.43,77.47 19.43,69.22 10.16,69.22 9.53,68.58 8.89,69.22 1.27,69.22
  pour Bottom (no thermals): 1.27,84.45 14.61,84.45 14.61,78.11 15.24,77.47 21.59,77.47 22.23,76.83 22.23,68.58 1.27,68.58
  pour Top (isolate 0.254, no thermals): 175.9,67.94 175.9,75.56 175.26,76.2 171.07,76.2 171.07,77.85 168.91,80.01 168.91,83.19 169.54,83.82 187.96,83.82 188.59,83.19 188.59,68.58 176.53,68.58
  pour Bottom (isolate 0.254, no thermals): 168.91,76.2 168.28,76.83 168.28,84.45 189.23,84.45 189.23,68.58 175.9,68.58 175.9,75.56 174.62,76.2
  pour Top (isolate 0.254, no thermals): 1.27,57.78 14.61,57.78 14.61,51.44 15.24,50.8 19.43,50.8 19.43,42.55 10.16,42.55 9.53,41.91 8.89,42.55 1.27,42.55
  pour Bottom (no thermals): 1.27,57.78 14.61,57.78 14.61,51.44 15.24,50.8 21.59,50.8 22.23,50.16 22.23,41.91 1.27,41.91
  pour Top (isolate 0.254, no thermals): 175.9,41.27 175.9,48.9 175.26,49.53 171.07,49.53 171.07,51.18 168.91,53.34 168.91,56.52 169.54,57.15 187.96,57.15 188.59,56.52 188.59,41.91 176.53,41.91
  pour Bottom (isolate 0.254, no thermals): 168.28,50.16 168.28,57.78 189.23,57.78 189.23,41.91 175.9,41.91 175.9,48.9 175.26,49.53 168.91,49.53
  pour Top (isolate 0.254, rank 2): 189.23,31.75 189.23,5.08 arc-90 185.42,1.27 5.08,1.27 arc-90 1.27,5.08 1.27,31.75 80.64,31.75 81.28,32.38 81.28,114.94 78.11,113.67 78.11,137.79 77.47,138.43 1.27,138.43 1.27,142.24 arc-90 5.08,146.05 185.42,146.05 arc-90 189.23,142.24 189.23,138.43 113.03,138.43 112.39,137.79 112.39,113.67 109.22,114.94 109.22,32.38 109.86,31.75
  pour Bottom (isolate 0.254, rank 2): 76.2,32.38 76.2,137.79 75.56,138.43 1.27,138.43 1.27,142.24 arc-90 5.08,146.05 185.42,146.05 arc-90 189.23,142.24 189.23,138.43 114.94,138.43 114.3,137.79 114.3,32.38 114.94,31.75 189.23,31.75 189.23,5.08 arc-90 185.42,1.27 5.08,1.27 arc-90 1.27,5.08 1.27,31.75 75.56,31.75
  pour Bottom: 1.27,138.43 14.61,138.43 14.61,122.56 15.24,121.92 14.61,121.28 14.61,95.89 15.24,95.25 14.61,94.61 14.61,69.22 15.24,68.58 14.61,67.94 14.61,42.55 15.24,41.91 14.61,41.27 14.61,32.38 15.24,31.75 1.27,31.75
  pour Bottom: 189.23,138.43 175.9,138.43 175.9,111.76 175.26,111.12 175.9,110.49 175.9,85.09 175.26,84.45 175.9,83.82 175.9,58.42 175.26,57.78 175.9,57.15 175.9,32.38 175.26,31.75 189.23,31.75
  pour Top (no thermals): 173.99,21.84 176.53,21.84 176.53,21.34 173.99,21.34
I2C_SCL  (via drill 0.35)
  Top 0.254: IC11.1 v90.17,127 | IC14.1 v90.17,59.05 | IC15.1 v90.17,43.18 | R58.1 v43.18,26.67 43.18,27.94 42.55,28.57 31.52,28.57 30.88,27.94 IC9.28
  Bottom 0.254: v90.17,127 v90.17,59.05 v90.17,43.18 90.17,26.04 89.53,25.4 43.81,25.4 43.18,26.04 v43.18,26.67
I2C_SDA  (via drill 0.35)
  Top 0.254: IC11.2 v91.44,127 | IC14.2 v91.44,59.05 | IC15.2 v91.44,43.18 | IC9.27 31.68,27.3 32.31,27.94 40.01,27.94 40.64,27.3 v40.64,26.67 R59.2
  Bottom 0.254: v91.44,127 v91.44,59.05 v91.44,43.18 91.44,25.4 90.81,24.77 41.27,24.77 40.64,25.4 v40.64,26.67
I_OUT_1
  Top 0.254: IC12.13 94.61,113.03 93.98,113.67 49.53,113.67 48.9,114.3 IC1.7
I_OUT_2
  Top 0.254: IC12.15 92.08,111.76 91.44,112.39 82.55,112.39 81.92,111.76 81.92,87.63 81.28,87 49.53,87 48.9,87.63 IC2.7
I_OUT_3
  Top 0.254: IC12.2 92.08,98.42 91.44,97.79 83.82,97.79 83.19,97.16 83.19,85.72 81.28,83.82 81.28,60.96 80.64,60.33 49.53,60.33 48.9,60.96 IC3.7
I_OUT_4
  Top 0.254: IC4.7 48.9,34.29 49.53,33.66 80.64,33.66 81.28,34.29 81.28,58.42 82.55,59.69 82.55,69.85 85.09,72.39 85.09,95.89 85.72,96.52 95.25,96.52 95.89,97.16 IC12.5
I_OUT_5
  Top 0.254: IC13.1 90.81,70.48 91.44,69.85 111.76,69.85 112.39,69.22 112.39,61.59 109.22,58.42 109.22,34.29 109.86,33.66 142.24,33.66 142.88,34.29 IC5.7
I_OUT_6
  Top 0.254: IC13.4 94.61,71.75 95.25,71.12 113.03,71.12 113.67,70.48 113.67,60.96 114.3,60.33 142.24,60.33 142.88,60.96 IC6.7
I_OUT_7
  Top 0.254: IC13.12 95.89,86.36 96.52,87 142.24,87 142.88,87.63 IC7.7
I_OUT_8
  Top 0.254: IC13.14 93.34,87.63 93.98,88.27 108.58,88.27 109.22,88.9 109.22,113.03 109.86,113.67 142.24,113.67 142.88,114.3 IC8.7
INT_BTN  (via drill 0.35)
  Top 0.254: D33.C v99.06,119.38 | D34.C 99.06,33.02 98.42,32.38 v93.98,32.38 | v25.4,26.04 27.53,26.04 IC9.32
  Bottom 0.254: v99.06,119.38 94.61,119.38 93.98,118.75 v93.98,32.38 93.98,24.13 93.34,23.5 35.56,23.5 34.29,24.77 31.11,24.77 30.48,24.13 30.48,23.5 29.84,22.86 26.04,22.86 25.4,23.5 v25.4,26.04
INT_CAN  (via drill 0.35)
  Top 0.254: IC9.1 v24.13,24.39 | IC16.4 132.08,13.34 131.44,12.7 131.44,12.06 130.81,11.43 122.56,11.43 121.92,12.06 121.92,15.24 121.28,15.88 43.18,15.88 42.55,15.24 42.55,13.34 v43.18,12.7
  Bottom 0.254: v24.13,24.39 24.13,13.34 24.77,12.7 v43.18,12.7
IV_OUT_A  (via drill 0.35)
  Top 0.254: IC13.3 93.34,80.01 93.98,80.64 v96.52,80.64 | IC9.23 33.66,23.59 33.02,22.95 v33.02,22.23
  Bottom 0.254: v96.52,80.64 96.52,22.86 95.89,22.23 v33.02,22.23
IV_OUT_B  (via drill 0.35)
  Top 0.254: IC12.3 93.34,105.41 93.98,106.05 v95.25,106.05 | IC9.24 32.38,24.39 31.75,23.75 v31.75,22.23
  Bottom 0.254: v95.25,106.05 95.25,23.5 94.61,22.86 34.29,22.86 33.66,23.5 32.38,23.5 31.75,22.86 v31.75,22.23
LED  (via drill 0.35)
  Top 0.254: IC9.12 30.08,15.64 v30.48,15.24 | R66.2 92.71,8.57 93.03,9.21 93.34,8.89 v94.61,8.89
  Bottom 0.254: v30.48,15.24 32.38,15.24 36.83,19.68 93.98,19.68 94.61,19.05 v94.61,8.89
MOSFET_1  (via drill 0.35)
  Top 0.254: IC14.14 95.25,68.58 94.61,69.22 87,69.22 86.36,69.85 86.36,78.74 v87.63,80.01 | v80.01,88.9 80.64,89.53 80.64,112.39 80.01,113.03 v28.57,113.03 | R2.1 v28.57,118.75
  Bottom 0.254: v87.63,80.01 87.63,86.36 87,87 80.64,87 80.01,87.63 v80.01,88.9 | v28.57,118.75 v28.57,113.03
MOSFET_2  (via drill 0.35)
  Top 0.254: IC14.15 93.98,67.94 93.34,68.58 86.36,68.58 85.72,69.22 85.72,80.01 v86.36,80.64 | v80.01,85.72 79.38,86.36 v28.57,86.36 | R9.1 v28.57,92.08
  Bottom 0.254: v86.36,80.64 86.36,85.09 85.72,85.72 v80.01,85.72 | v28.57,92.08 v28.57,86.36
MOSFET_3  (via drill 0.35)
  Top 0.254: R16.1 v28.57,65.41 | IC14.16 92.71,67.31 92.08,67.94 v83.82,67.94 | v79.38,59.05 78.74,59.69 v28.57,59.69
  Bottom 0.254: v83.82,67.94 80.01,67.94 79.38,67.31 v79.38,59.05 | v28.57,59.69 v28.57,65.41
MOSFET_4  (via drill 0.35)
  Top 0.254: IC14.17 91.44,66.67 90.81,67.31 84.45,67.31 83.19,66.04 83.19,59.05 81.92,57.78 81.92,33.66 81.28,33.02 v28.57,33.02 | R23.1 v28.57,38.73
  Bottom 0.254: v28.57,38.73 v28.57,33.02
MOSFET_5
  Top 0.254: IC14.10 100.33,66.67 100.97,67.31 104.14,67.31 108.58,62.87 108.58,33.66 109.22,33.02 180.34,33.02 180.97,33.66 180.97,36.52 R35.1
MOSFET_6  (via drill 0.35)
  Top 0.254: IC14.11 99.06,67.31 99.69,67.94 104.78,67.94 v111.12,61.59 | R42.1 180.97,63.19 180.97,60.33 180.34,59.69 v113.03,59.69
  Bottom 0.254: v111.12,61.59 v113.03,59.69
MOSFET_7  (via drill 0.35)
  Top 0.254: R49.1 180.97,89.86 180.97,87 180.34,86.36 110.49,86.36 109.86,85.72 v109.86,75.56 | IC14.12 97.79,67.94 98.42,68.58 105.41,68.58 106.68,67.31 v109.86,67.31
  Bottom 0.254: v109.86,67.31 v109.86,75.56
MOSFET_8  (via drill 0.35)
  Top 0.254: R56.1 180.97,116.53 180.97,113.67 180.34,113.03 110.49,113.03 109.86,112.39 109.86,89.53 v110.49,88.9 | IC14.13 96.52,68.58 97.16,69.22 107.95,69.22 v108.58,68.58 | v108.58,75.56 109.22,76.2 109.22,85.09 v108.58,85.72
  Bottom 0.254: v108.58,85.72 108.58,86.36 110.49,88.27 v110.49,88.9 | v108.58,68.58 109.22,69.22 109.22,74.93 v108.58,75.56
N$1
  Top 0.254: R66.1 91.12,9.21 90.81,8.89 90.81,11.91 D36.A
N$2
  Top 0.254: IC11.5 R62.1
N$3
  Top 0.254: C19.1 16.25,19.63 17.78,19.63 | 17.78,19.63 XTAL1.1 | IC9.7 24.67,19.59 23.5,18.41 18.41,18.41 17.78,19.05 17.78,19.63
N$4
  Top 0.254: C20.1 16.19,16.19 16.51,16.51 16.51,17.14 17.14,17.78 21.59,17.78 | XTAL1.3 21.42,16.34 21.59,16.51 21.59,17.78 | IC9.8 25.14,18.79 24.13,17.78 21.59,17.78
N$5
  Top 0.254: R65.1 84.78,9.21 84.45,8.89 84.45,11.91 D35.A
N$6
  Top 0.254: X1.6 C21.1
N$7
  Top 0.254: IC15.5 95.25,38.73 95.89,38.1 R64.1
N$8
  Top 0.254: IC15.4 93.98,38.73 93.34,38.1 R63.1
N$9
  Top 0.254: IC15.10 100.33,46.99 100.97,46.35 103.5,46.35 104.14,45.72 S10.1
N$10
  Top 0.254: IC15.11 99.06,46.35 99.69,45.72 102.87,45.72 103.5,45.09 103.5,33.66 101.6,31.75 S10.2
N$11
  Top 0.254: IC15.12 97.79,45.72 98.42,45.09 102.23,45.09 102.87,44.45 102.87,34.29 99.06,30.48 S10.3
N$12
  Top 0.254: S10.4 96.52,31.11 97.16,31.75 99.06,31.75 102.23,34.92 102.23,43.81 101.6,44.45 97.16,44.45 96.52,45.09 IC15.13
N$13
  Top 0.254: IC15.14 95.25,45.09 94.61,44.45 88.27,44.45 87.63,43.81 87.63,36.83 93.98,30.48 S10.5
N$14
  Top 0.254: IC15.15 93.98,45.72 93.34,45.09 87.63,45.09 87,44.45 87,36.2 91.44,31.75 S10.6
N$15
  Top 0.254: IC15.16 92.71,46.35 92.08,45.72 87,45.72 86.36,45.09 86.36,35.56 88.9,33.02 S10.7
N$16
  Top 0.254: 170.81,15.24 186.06,15.24 186.69,14.61 186.69,12.7 R69.1 | 156.84,15.24 170.81,15.24 | 170.81,15.24 X4.3 | IC17.6 143.51,12.06 142.88,12.7 142.88,14.61 143.51,15.24 156.84,15.24 | 156.84,15.24 X3.3
N$17
  Top 0.254: X4.2 169.54,12.7 | 169.54,12.7 JP1.1 | X3.2 155.57,12.7 | 155.57,12.7 169.54,12.7 | 155.57,12.7 147.32,12.7 146.69,13.34 IC17.7
N$18
  Top 0.254: IC17.1 137.79,14.61 137.16,13.97 137.16,12.06 136.53,11.43 133.35,11.43 132.72,10.79 132.72,9.53 | 132.72,9.53 IC16.1 | 132.72,9.53 132.72,8.89 132.08,8.26 121.28,8.26 120.65,8.89 120.65,13.97 120.02,14.61 100.97,14.61 100.33,13.97 100.33,12.06 100.17,11.91 D37.C
N$19
  Top 0.254: IC17.4 136.53,10.79 | 136.53,10.79 IC16.2 | 136.53,10.79 136.53,8.26 135.89,7.62 120.65,7.62 120.02,8.26 120.02,13.34 119.38,13.97 107.31,13.97 106.68,13.34 106.68,12.06 106.53,11.91 D38.C
N$20
  Top 0.254: IC16.5 132.72,14.61 132.08,15.24 132.08,18.41 131.44,19.05 130.4,19.05 XTAL2.1 130.06,19.05 127.95,19.05 C32.2
N$21
  Top 0.254: IC16.6 133.35,15.88 132.72,16.51 132.72,22.23 133.35,22.86 133.99,22.86 | 133.99,22.86 135.89,22.86 136.53,22.23 C33.2 | XTAL2.3 133.93,22.8 133.99,22.86
N$22
  Top 0.254: D37.A 97.16,10.95 97.16,9.21 R67.1
N$23
  Top 0.254: D38.A 103.5,10.95 103.5,9.21 R68.1
N$24
  Top 0.254: JP1.2 R69.2
N$25
  pour Top (isolate 0.254): 60.96,134.62 71.75,134.62 72.39,133.99 72.39,130.48 73.18,129.69 74.93,129.69 74.93,114.94 60.96,114.94
  pour Top (isolate 0.254, no thermals): 66.04,134.62 71.75,134.62 72.39,133.99 72.39,127.64 66.04,127.64
  pour Top (isolate 0.254, no thermals): 60.96,127.91 74.93,127.91 75.56,127.28 75.56,115.57 74.93,114.94 60.96,114.94
  pour Bottom (no thermals): 60.96,137.79 75.56,137.79 75.56,114.94 60.96,114.94
N$26  (via drill 0.4)
  Top 0.254: D3.A 51.44,133.99
  other vias: 49.15,119 50.16,119 51.18,119 52.2,119 53.21,119 51.18,120.02 52.2,120.02 53.21,120.02 52.2,121.03 53.21,121.03 54.23,119 49.15,120.02 50.16,120.02 54.23,120.02 54.23,121.03 55.24,121.03 55.24,120.02 55.24,119 56.26,121.03 56.26,120.02 56.26,119
  pour Top (isolate 0.254, no thermals): 51.44,135.25 52.07,134.62 59.69,134.62 59.69,118.36 48.51,118.36 48.51,126.36 49.15,127 50.8,127 51.44,127.64
  pour Bottom (no thermals): 49.53,137.79 59.69,137.79 59.69,118.11 48.51,118.11 48.51,126.36 49.53,127.38
N$27
  Top 0.254: D4.C 74.3,134.77 Q2.2
N$28
  Top 0.254: D3.C 56.52,136.53 | 56.52,136.53 R5.2 | Q2.3 76.83,136.06 76.83,137.16 76.2,137.79 57.15,137.79 56.52,137.16 56.52,136.53
N$29
  Top 0.254: Q2.1 74.14,136.53 R7.2
N$30
  Top 0.254: IC1.6 47.62,115.57 46.99,114.94 C1.1
N$31
  Top 0.254: D2.C 50.16,137.16 49.53,137.79 36.2,137.79 35.56,137.16 35.56,120.02 34.92,119.38 30.8,119.38 R3.2
N$32
  Top 0.254: R2.2 OK1.1
N$33
  Top 0.254: OK1.4 19.68,118.75 20.95,117.47 33.02,117.47 33.66,118.11 R4.1
N$34  (via drill 0.4)
  other vias: 47.37,119 46.35,119 46.35,120.02 47.37,120.02 45.34,119 45.34,120.02 44.32,119 44.32,120.02 44.32,121.03 43.31,119 42.29,119 41.27,119 41.27,120.02 41.27,121.03 42.29,121.03 43.31,121.03 43.31,120.02 42.29,120.02 40.26,119 40.26,120.02 40.26,121.03
  pour Bottom (no thermals): 36.2,137.79 48.9,137.79 48.9,127.64 48.01,126.75 48.01,118.11 36.2,118.11
  pour Top (isolate 0.254): 36.2,136.53 36.83,137.16 48.26,137.16 48.26,130.43 49.02,129.67 50.8,129.67 50.8,128.27 50.16,127.64 48.9,127.64 48.01,126.75 48.01,118.36 38.99,118.36 38.1,117.47 36.2,117.47
  pour Top (isolate 0.254, no thermals): 36.2,118.36 36.2,136.53 36.83,137.16 48.01,137.16 48.01,118.36
N$35
  Top 0.254: R1.2 14.61,120.65 15.24,120.02 OK1.3 19.68,120.02 20.32,120.65 Q1.3 Q1.4
N$36  (via drill 0.4)
  other vias: 15.62,137.41 16.38,136.65 17.14,137.41 15.62,135.89 15.62,134.37 16.38,135.13 15.62,132.84 16.38,133.6 16.38,132.08 17.91,136.65 18.67,137.41 19.43,136.65 20.19,137.41 20.95,136.65 21.72,137.41 17.14,132.84 17.14,134.37
  pour Bottom (no thermals): 34.92,137.79 15.24,137.79 15.24,132.08 15.88,131.44 22.23,131.44 22.86,130.81 22.86,121.92 34.92,121.92
  pour Top (isolate 0.254): 15.24,137.79 34.92,137.79 34.92,120.65 34.29,120.02 32.23,120.02 31.6,120.65 29.84,120.65 29.84,122 22.86,122 22.86,130.81 22.23,131.44 15.88,131.44 15.24,132.08
  pour Top (isolate 0.254, no thermals): 15.24,137.79 34.92,137.79 34.92,120.65 34.29,120.02 32.26,120.02 31.62,120.65 31.62,122.56 22.86,122.56 22.86,130.81 22.23,131.44 15.88,131.44 15.24,132.08
N$37
  pour Top (isolate 0.254): 129.54,134.62 118.75,134.62 118.11,133.99 118.11,130.48 117.32,129.69 115.57,129.69 115.57,127.91 114.94,127.28 114.94,115.57 115.57,114.94 129.54,114.94
  pour Top (isolate 0.254, no thermals): 118.75,134.62 124.46,134.62 124.46,127 129.54,127 129.54,115.57 115.57,115.57 115.57,127 118.11,127 118.11,133.99
  pour Bottom (isolate 0.254, no thermals): 114.94,137.79 129.54,137.79 129.54,114.94 114.94,114.94
N$38  (via drill 0.4)
  Top 0.254: D30.A 139.06,134.62
  other vias: 141.35,119 140.34,119 141.35,120.02 140.34,120.02 139.32,119 139.32,120.02 138.3,119 137.29,119 136.27,119 135.25,119 134.24,119 138.3,120.02 138.3,121.03 137.29,120.02 137.29,121.03 136.27,121.03 136.27,120.02 135.25,120.02 135.25,121.03 134.24,121.03 134.24,120.02
  pour Top (isolate 0.254, no thermals): 130.81,118.36 130.81,134.62 138.43,134.62 139.06,135.25 139.06,127.64 139.7,127 141.35,127 141.99,126.36 141.99,118.36
  pour Bottom (isolate 0.254, no thermals): 130.81,137.79 140.97,137.79 140.97,127.38 141.99,126.36 141.99,118.11 130.81,118.11
N$39
  Top 0.254: Q15.2 114.61,134.94 114.94,134.62 115.57,134.62 116.2,133.99 D29.C
N$40
  Top 0.254: D30.C 133.99,136.53 | 133.99,136.53 R52.2 | Q15.3 113.67,135.89 113.03,136.53 113.03,137.16 113.67,137.79 133.35,137.79 133.99,137.16 133.99,136.53
N$41
  Top 0.254: Q15.1 114.79,137.16 118.11,137.16 118.75,136.53 R50.2
N$42
  Top 0.254: IC8.6 141.6,115.57 140.97,114.94 C15.1
N$43
  Top 0.254: R54.2 159.71,119.38 155.57,119.38 154.94,120.02 154.94,137.16 154.31,137.79 140.97,137.79 140.34,137.16 D31.C
N$44
  Top 0.254: R56.2 OK8.1
N$45
  Top 0.254: R53.1 157.48,118.11 158.75,116.84 OK8.4
N$46  (via drill 0.4)
  other vias: 143.13,119 143.13,120.02 144.15,120.02 144.15,119 145.16,119 145.16,120.02 146.18,119 146.18,120.02 146.18,121.03 147.19,121.03 147.19,120.02 147.19,119 148.21,119 148.21,120.02 148.21,121.03 149.22,121.03 149.22,120.02 149.22,119 150.24,119 150.24,120.02 150.24,121.03
  pour Top (isolate 0.254): 142.49,118.36 142.49,126.75 141.6,127.64 140.34,127.64 139.7,128.27 139.7,129.67 141.48,129.67 142.24,130.43 142.24,137.16 153.67,137.16 154.31,136.53 154.31,117.47 152.4,117.47 151.51,118.36
  pour Top (isolate 0.254, no thermals): 142.49,119.38 142.49,137.16 153.67,137.16 154.31,136.53 154.31,119.38
  pour Bottom (isolate 0.254, no thermals): 142.49,118.11 142.49,126.75 141.6,127.64 141.6,137.79 154.31,137.79 154.31,118.11
N$47  (via drill 0.35)
  Top 0.254: OK8.3 170.81,118.17 v170.81,120.02 R55.2 | Q16.3 Q16.4 168.91,132.08 168.28,132.72 168.28,137.16 168.91,137.79 188.59,137.79 189.23,137.16 189.23,120.65 188.59,120.02 v177.16,120.02
  Bottom 0.254: v177.16,120.02 v170.81,120.02
N$48  (via drill 0.4)
  other vias: 174.88,122.94 173.35,122.94 171.96,122.94 170.56,122.94 169.04,122.94 174.12,123.7 172.59,123.7 171.2,123.7 169.8,123.7 174.88,124.46 174.12,125.22 174.88,125.98 174.12,126.75 174.88,127.51 174.12,128.27 173.35,127.51 173.35,125.98
  pour Top (isolate 0.254): 155.57,137.79 155.57,120.65 156.21,120.02 158.27,120.02 158.9,120.65 160.66,120.65 160.66,122 175.26,122 175.26,128.27 174.62,128.91 168.28,128.91 167.64,129.54 167.64,137.79
  pour Top (isolate 0.254, no thermals): 155.57,120.65 156.21,120.02 158.12,120.02 158.24,120.14 158.24,122.56 175.26,122.56 175.26,128.27 174.62,128.91 168.28,128.91 167.64,129.54 167.64,137.79 155.57,137.79
  pour Bottom (isolate 0.254, no thermals): 155.57,137.79 167,137.79 167.64,137.16 167.64,129.54 168.28,128.91 174.62,128.91 175.26,128.27 175.26,121.92 155.57,121.92
N$49
  pour Top (isolate 0.254): 60.96,107.95 71.75,107.95 72.39,107.31 72.39,103.81 73.18,103.02 74.93,103.02 74.93,88.27 60.96,88.27
  pour Top (isolate 0.254, no thermals): 66.04,107.95 71.75,107.95 72.39,107.31 72.39,100.97 66.04,100.97
  pour Top (isolate 0.254, no thermals): 60.96,101.24 74.93,101.24 75.56,100.61 75.56,88.9 74.93,88.27 60.96,88.27
  pour Bottom (no thermals): 60.96,111.12 75.56,111.12 75.56,88.27 60.96,88.27
N$50  (via drill 0.4)
  Top 0.254: D7.A 51.44,107.32
  other vias: 49.15,92.33 50.16,92.33 51.18,92.33 52.2,92.33 53.21,92.33 51.18,93.34 52.2,93.34 53.21,93.34 52.2,94.36 53.21,94.36 54.23,92.33 49.15,93.34 50.16,93.34 54.23,93.34 54.23,94.36 55.24,94.36 55.24,93.34 55.24,92.33 56.26,94.36 56.26,93.34 56.26,92.33
  pour Top (isolate 0.254, no thermals): 51.44,108.58 52.07,107.95 59.69,107.95 59.69,91.69 48.51,91.69 48.51,99.69 49.15,100.33 50.8,100.33 51.44,100.97
  pour Bottom (no thermals): 49.53,111.12 59.69,111.12 59.69,91.44 48.51,91.44 48.51,99.69 49.53,100.71
N$51
  Top 0.254: D8.C 74.3,108.1 Q4.2
N$52
  Top 0.254: D7.C 56.52,109.86 | 56.52,109.86 R12.2 | Q4.3 76.83,109.39 76.83,110.49 76.2,111.12 57.15,111.12 56.52,110.49 56.52,109.86
N$53
  Top 0.254: Q4.1 74.14,109.86 R14.2
N$54
  Top 0.254: IC2.6 47.62,88.9 46.99,88.27 C3.1
N$55
  Top 0.254: D6.C 50.16,110.49 49.53,111.12 36.2,111.12 35.56,110.49 35.56,93.34 34.92,92.71 30.8,92.71 R10.2
N$56
  Top 0.254: R9.2 OK2.1
N$57
  Top 0.254: OK2.4 19.68,92.08 20.95,90.81 33.02,90.81 33.66,91.44 R11.1
N$58  (via drill 0.4)
  other vias: 47.37,92.33 46.35,92.33 46.35,93.34 47.37,93.34 45.34,92.33 45.34,93.34 44.32,92.33 44.32,93.34 44.32,94.36 43.31,92.33 42.29,92.33 41.27,92.33 41.27,93.34 41.27,94.36 42.29,94.36 43.31,94.36 43.31,93.34 42.29,93.34 40.26,92.33 40.26,93.34 40.26,94.36
  pour Bottom (no thermals): 36.2,111.12 48.9,111.12 48.9,100.97 48.01,100.08 48.01,91.44 36.2,91.44
  pour Top (isolate 0.254): 36.2,109.86 36.83,110.49 48.26,110.49 48.26,103.76 49.02,103 50.8,103 50.8,101.6 50.16,100.97 48.9,100.97 48.01,100.08 48.01,91.69 38.99,91.69 38.1,90.81 36.2,90.81
  pour Top (isolate 0.254, no thermals): 36.2,91.69 36.2,109.86 36.83,110.49 48.01,110.49 48.01,91.69
N$59
  Top 0.254: R8.2 14.61,93.98 15.24,93.34 OK2.3 19.68,93.34 20.32,93.98 Q3.3 Q3.4
N$60  (via drill 0.4)
  other vias: 15.62,110.74 16.38,109.98 17.14,110.74 15.62,109.22 15.62,107.7 16.38,108.46 15.62,106.17 16.38,106.93 16.38,105.41 17.91,109.98 18.67,110.74 19.43,109.98 20.19,110.74 20.95,109.98 21.72,110.74 17.14,106.17 17.14,107.7
  pour Bottom (no thermals): 34.92,111.12 15.24,111.12 15.24,105.41 15.88,104.78 22.23,104.78 22.86,104.14 22.86,95.25 34.92,95.25
  pour Top (isolate 0.254): 15.24,111.12 34.92,111.12 34.92,93.98 34.29,93.34 32.23,93.34 31.6,93.98 29.84,93.98 29.84,95.33 22.86,95.33 22.86,104.14 22.23,104.78 15.88,104.78 15.24,105.41
  pour Top (isolate 0.254, no thermals): 15.24,111.12 34.92,111.12 34.92,93.98 34.29,93.34 32.26,93.34 31.62,93.98 31.62,95.89 22.86,95.89 22.86,104.14 22.23,104.78 15.88,104.78 15.24,105.41
N$61
  pour Top (isolate 0.254): 129.54,107.95 118.75,107.95 118.11,107.31 118.11,103.81 117.32,103.02 115.57,103.02 115.57,101.24 114.94,100.61 114.94,88.9 115.57,88.27 129.54,88.27
  pour Top (isolate 0.254, no thermals): 118.75,107.95 124.46,107.95 124.46,100.33 129.54,100.33 129.54,88.9 115.57,88.9 115.57,100.33 118.11,100.33 118.11,107.31
  pour Bottom (isolate 0.254, no thermals): 114.94,111.12 129.54,111.12 129.54,88.27 114.94,88.27
N$62  (via drill 0.4)
  Top 0.254: D26.A 139.06,107.95
  other vias: 141.35,92.33 140.34,92.33 141.35,93.34 140.34,93.34 139.32,92.33 139.32,93.34 138.3,92.33 137.29,92.33 136.27,92.33 135.25,92.33 134.24,92.33 138.3,93.34 138.3,94.36 137.29,93.34 137.29,94.36 136.27,94.36 136.27,93.34 135.25,93.34 135.25,94.36 134.24,94.36 134.24,93.34
  pour Top (isolate 0.254, no thermals): 130.81,91.69 130.81,107.95 138.43,107.95 139.06,108.58 139.06,100.97 139.7,100.33 141.35,100.33 141.99,99.69 141.99,91.69
  pour Bottom (isolate 0.254, no thermals): 130.81,111.12 140.97,111.12 140.97,100.71 141.99,99.69 141.99,91.44 130.81,91.44
N$63
  Top 0.254: Q13.2 114.61,108.27 114.94,107.95 115.57,107.95 116.2,107.31 D25.C
N$64
  Top 0.254: D26.C 133.99,109.86 | 133.99,109.86 R45.2 | Q13.3 113.67,109.22 113.03,109.86 113.03,110.49 113.67,111.12 133.35,111.12 133.99,110.49 133.99,109.86
N$65
  Top 0.254: Q13.1 114.79,110.49 118.11,110.49 118.75,109.86 R43.2
N$66
  Top 0.254: IC7.6 141.6,88.9 140.97,88.27 C13.1
N$67
  Top 0.254: R47.2 159.71,92.71 155.57,92.71 154.94,93.34 154.94,110.49 154.31,111.12 140.97,111.12 140.34,110.49 D27.C
N$68
  Top 0.254: R49.2 OK7.1
N$69
  Top 0.254: R46.1 157.48,91.44 158.75,90.17 OK7.4
N$70  (via drill 0.4)
  other vias: 143.13,92.33 143.13,93.34 144.15,93.34 144.15,92.33 145.16,92.33 145.16,93.34 146.18,92.33 146.18,93.34 146.18,94.36 147.19,94.36 147.19,93.34 147.19,92.33 148.21,92.33 148.21,93.34 148.21,94.36 149.22,94.36 149.22,93.34 149.22,92.33 150.24,92.33 150.24,93.34 150.24,94.36
  pour Top (isolate 0.254): 142.49,91.69 142.49,100.08 141.6,100.97 140.34,100.97 139.7,101.6 139.7,103 141.48,103 142.24,103.76 142.24,110.49 153.67,110.49 154.31,109.86 154.31,90.81 152.4,90.81 151.51,91.69
  pour Top (isolate 0.254, no thermals): 142.49,92.71 142.49,110.49 153.67,110.49 154.31,109.86 154.31,92.71
  pour Bottom (isolate 0.254, no thermals): 142.49,91.44 142.49,100.08 141.6,100.97 141.6,111.12 154.31,111.12 154.31,91.44
N$71  (via drill 0.35)
  Top 0.254: OK7.3 170.81,91.5 v170.81,93.34 R48.2 | Q14.3 Q14.4 168.91,105.41 168.28,106.05 168.28,110.49 168.91,111.12 188.59,111.12 189.23,110.49 189.23,93.98 188.59,93.34 v177.16,93.34
  Bottom 0.254: v177.16,93.34 v170.81,93.34
N$72  (via drill 0.4)
  other vias: 174.88,96.27 173.35,96.27 171.96,96.27 170.56,96.27 169.04,96.27 174.12,97.03 172.59,97.03 171.2,97.03 169.8,97.03 174.88,97.79 174.12,98.55 174.88,99.31 174.12,100.08 174.88,100.84 174.12,101.6 173.35,100.84 173.35,99.31
  pour Top (isolate 0.254): 155.57,111.12 155.57,93.98 156.21,93.34 158.27,93.34 158.9,93.98 160.66,93.98 160.66,95.33 175.26,95.33 175.26,101.6 174.62,102.23 168.28,102.23 167.64,102.87 167.64,111.12
  pour Top (isolate 0.254, no thermals): 155.57,93.98 156.21,93.34 158.12,93.34 158.24,93.47 158.24,95.89 175.26,95.89 175.26,101.6 174.62,102.23 168.28,102.23 167.64,102.87 167.64,111.12 155.57,111.12
  pour Bottom (isolate 0.254, no thermals): 155.57,111.12 167.64,111.12 167.64,102.87 168.28,102.23 174.62,102.23 175.26,101.6 175.26,95.25 155.57,95.25
N$73
  pour Top (isolate 0.254): 60.96,81.28 71.75,81.28 72.39,80.64 72.39,77.14 73.18,76.35 74.93,76.35 74.93,61.59 60.96,61.59
  pour Top (isolate 0.254, no thermals): 66.04,81.28 71.75,81.28 72.39,80.64 72.39,74.3 66.04,74.3
  pour Top (isolate 0.254, no thermals): 60.96,74.57 74.93,74.57 75.56,73.94 75.56,62.23 74.93,61.59 60.96,61.59
  pour Bottom (no thermals): 60.96,84.45 75.56,84.45 75.56,61.59 60.96,61.59
N$74  (via drill 0.4)
  Top 0.254: D11.A 51.44,80.65
  other vias: 49.15,65.66 50.16,65.66 51.18,65.66 52.2,65.66 53.21,65.66 51.18,66.67 52.2,66.67 53.21,66.67 52.2,67.69 53.21,67.69 54.23,65.66 49.15,66.67 50.16,66.67 54.23,66.67 54.23,67.69 55.24,67.69 55.24,66.67 55.24,65.66 56.26,67.69 56.26,66.67 56.26,65.66
  pour Top (isolate 0.254, no thermals): 51.44,81.92 52.07,81.28 59.69,81.28 59.69,65.02 48.51,65.02 48.51,73.03 49.15,73.66 50.8,73.66 51.44,74.3
  pour Bottom (no thermals): 49.53,84.45 59.69,84.45 59.69,64.77 48.51,64.77 48.51,73.03 49.53,74.04
N$75
  Top 0.254: D12.C 74.3,81.43 Q6.2
N$76
  Top 0.254: D11.C 56.52,83.19 | 56.52,83.19 R19.2 | Q6.3 76.83,82.72 76.83,83.82 76.2,84.45 57.15,84.45 56.52,83.82 56.52,83.19
N$77
  Top 0.254: Q6.1 74.14,83.19 R21.2
N$78
  Top 0.254: IC3.6 47.62,62.23 46.99,61.59 C5.1
N$79
  Top 0.254: D10.C 50.16,83.82 49.53,84.45 36.2,84.45 35.56,83.82 35.56,66.67 34.92,66.04 30.8,66.04 R17.2
N$80
  Top 0.254: R16.2 OK3.1
N$81
  Top 0.254: OK3.4 19.68,65.41 20.95,64.14 33.02,64.14 33.66,64.77 R18.1